# EAGLE design 0118-LEDz (EAGLE 9.6.2)
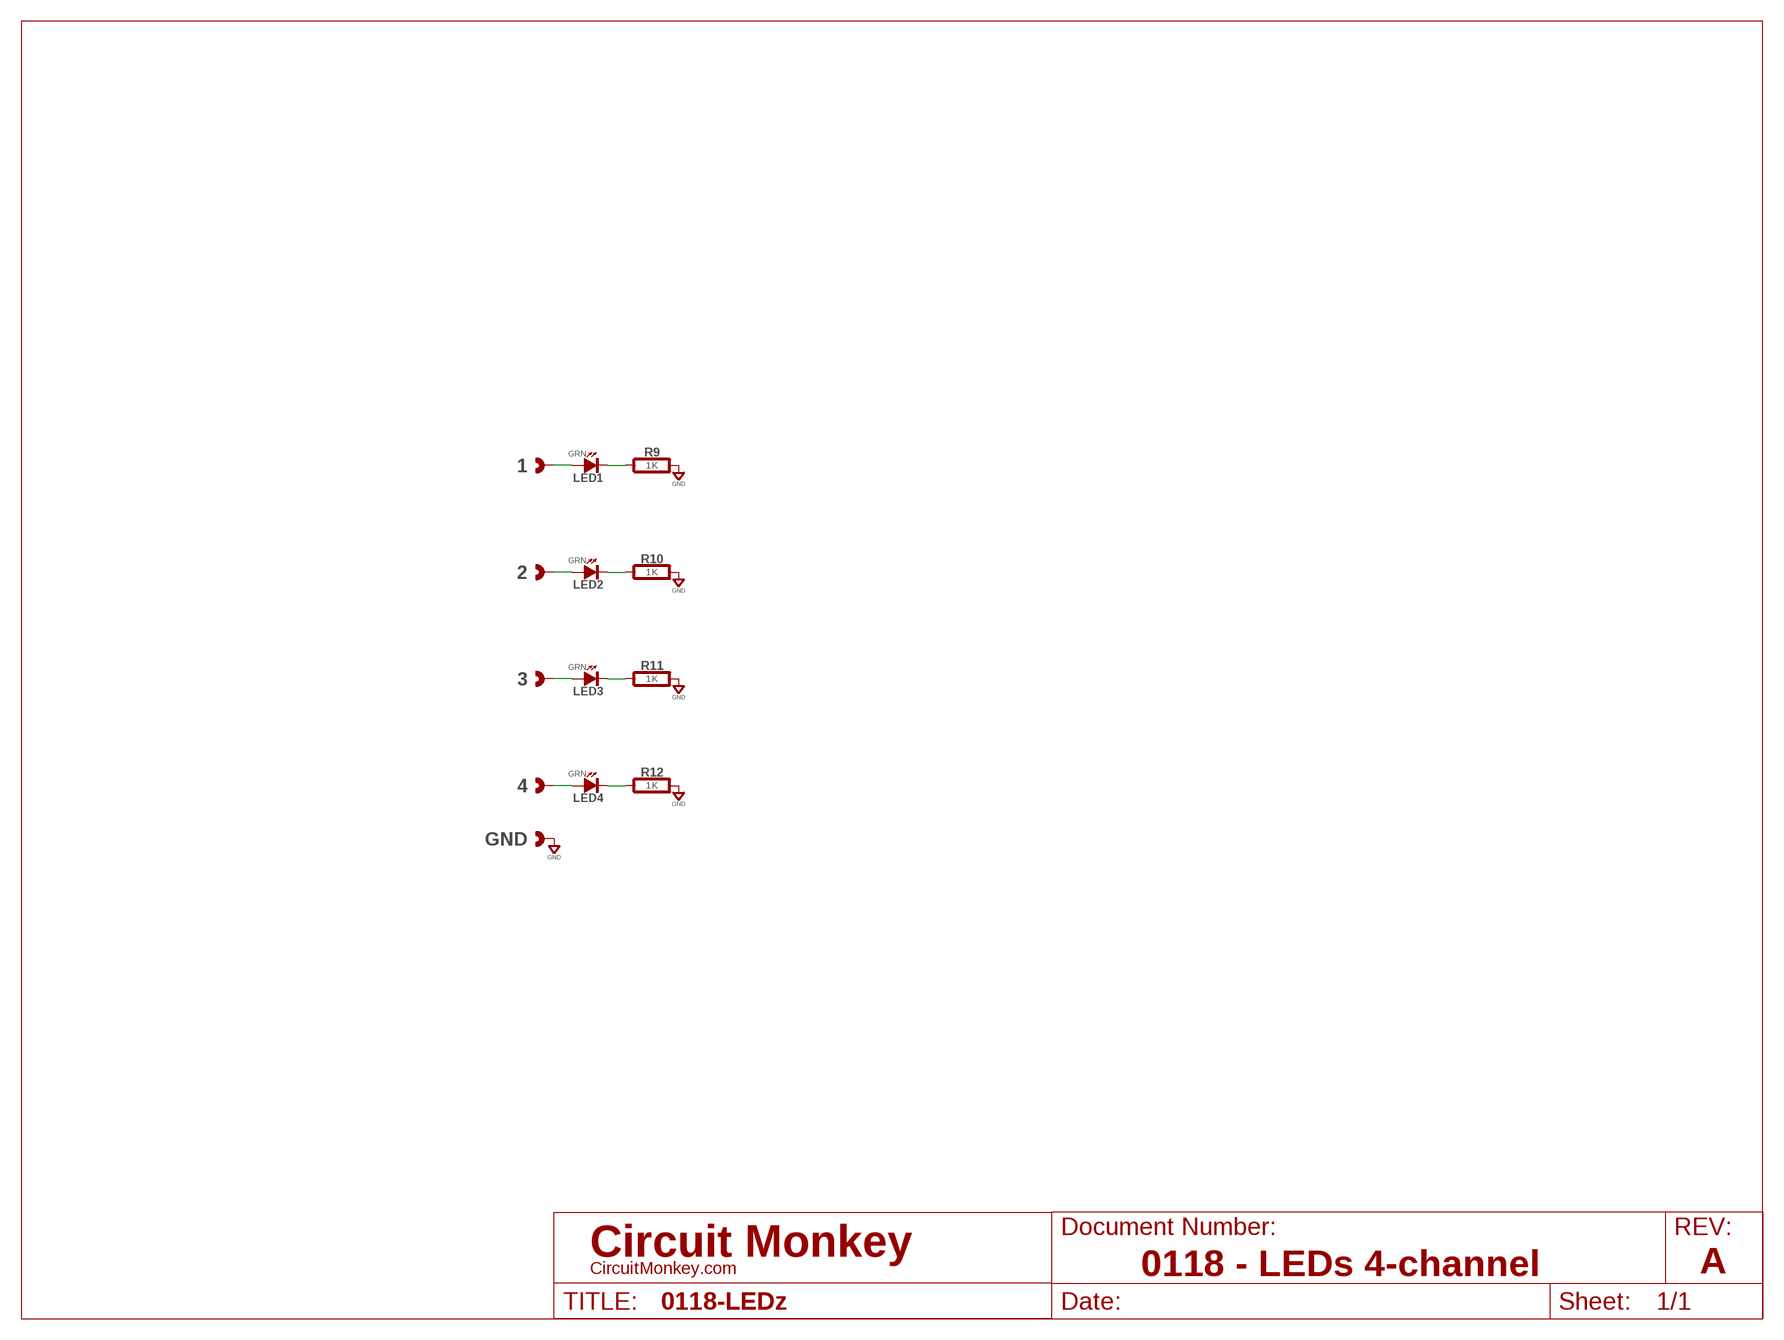
[diagram p0: schematic, sheet 1]
U$1 (LETTER_L-CIRCUITMONKEY): DOCUMENT_NUMBER: 0118 - LEDs 4-channel; REV: A

## Parts
1  CAST-01X12.00MM  [CAST01-2.00MM]
2  CAST-01X12.00MM  [CAST01-2.00MM]
3  CAST-01X12.00MM  [CAST01-2.00MM]
4  CAST-01X12.00MM  [CAST01-2.00MM]
GND  CAST-01X12.00MM  [CAST01-2.00MM]
LED1  GRN  SMT0603  [SMD_0603]
LED2  GRN  SMT0603  [SMD_0603]
LED3  GRN  SMT0603  [SMD_0603]
LED4  GRN  SMT0603  [SMD_0603]
R9  1K  RESISTOR0603  [0603-RES]
R10  1K  RESISTOR0603  [0603-RES]
R11  1K  RESISTOR0603  [0603-RES]
R12  1K  RESISTOR0603  [0603-RES]

## Nets
GND: GND.1 GND.P$1 GND.P$2 R9.2 R10.2 R11.2 R12.2
N$2: LED1.K(C) R9.1
N$6: LED2.K(C) R10.1
N$9: 1.1 1.P$1 1.P$2 LED1.A
N$10: 2.1 2.P$1 2.P$2 LED2.A
N$11: 3.1 3.P$1 3.P$2 LED3.A
N$12: 4.1 4.P$1 4.P$2 LED4.A
N$17: LED3.K(C) R11.1
N$19: LED4.K(C) R12.1

## Library data of the parts
1-4 GND = con-headers:CAST-01X1: Castelated Edge Hole Pad
LED1-LED4 = led:SMT: LED SMT
R9-R12 = rlc:RESISTOR: Resistor

## Board
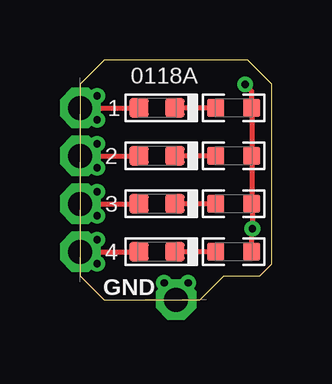
[diagram p1: board, top side]
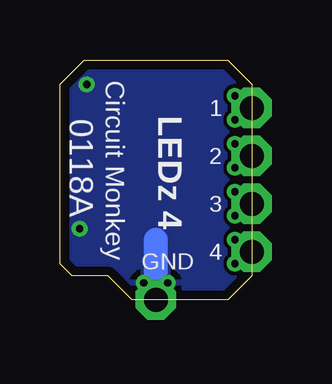
[diagram p2: board, bottom side, seen from below]

Size 8 x 10 mm. Coordinates in mm from the lower left corner, seen from the top.
Outline: 1,0 5,0 6,1 7.5,1 8,1.5 8,9 7,10 1,10 0,9 0,1 1,0
Copper layers (1*16): Top 0.0356mm / dielectric 1.5011mm / Bottom 0.0356mm
Design rules "OSH-CircuitMonkey *": minimum track width 6mil, minimum drill 12mil, track to track 6mil, track to pad 6mil, pad to pad 6mil, via to via 6mil, smd to smd 6mil, copper to edge 15mil, drill to drill 6mil, minimum pad ring 7mil, minimum via ring 7mil, stop-mask expansion 3mil, vias tented up to drill 13mil, thermal gap 10mil

### Footprints (pad centres in the part's own frame; a part is rotated, then mirrored left to right if it is on the bottom)
CAST01-2.00MM = drill 1 pad 1.7 octagon: 1 0,0 | drill 0.305: P$1 -0.7,0.5; P$2 -0.7,-0.5
SMD_0603 = smd 0.8 x 0.8: A 0.75,0; K -0.75,0
0603-RES = smd 0.711 x 0.762: 1 -0.752,0; 2 0.752,0

### Placement (x,y rotation side)
1  0,8 180 top
2  0,6 180 top
3  0,4 180 top
4  0,2 180 top
GND  4,0 270 top
LED1  3.2,8 180 top
LED2  3.2,6 180 top
LED3  3.2,4 180 top
LED4  3.2,2 180 top
R9  6.4,8 0 top
R10  6.4,6 0 top
R11  6.4,4 0 top
R12  6.4,2 0 top

### Tracks (layer width: path | path; a pad name or v marks a point on that pad's centre or on a via)
GND  (via drill 0.3)
  Top 0.152: R10.2 | R9.2 7.15,8.05 | R11.2 7.15,4.01 | R12.2 7.15,2.03
  Top 0.2: R12.2 7.15,2.93 v7.18,2.96 7.18,3.97 R11.2 R10.2 R9.2 7.15,8.71 v6.88,8.98
  Bottom 0.152: GND.1 3.9,0 4.17,0.28 3.85,0.3 3.85,0.15 GND.1 | GND.P$1 GND.P$2 3.5,0.5 GND.1
  Bottom 1: GND.1 4,2.5
  pour Bottom (rank 5): 5,0 1,0 0,1 0,9 1,10 7,10 8,9 8,1.5 7,0.5 5.5,0.5
N$2
  Top 0.2: R9.1 LED1.K
N$6
  Top 0.2: R10.1 LED2.K
N$9
  Top 0.16: 0.2,8 1.P$1 | 1.1 0.2,8 | 0.2,8 1.P$2
  Top 0.2: 1.1 LED1.A
N$10
  Top 0.16: 0.2,6 2.P$2 | 2.1 0.2,6 | 0.2,6 2.P$1
  Top 0.2: 2.1 LED2.A
N$11
  Top 0.152: 0.2,4 3.P$2 | 3.1 0.2,4 | 0.2,4 3.P$1
  Top 0.2: 3.1 LED3.A
N$12
  Top 0.152: 0.2,2 4.P$1 | 4.1 0.2,2 | 0.2,2 4.P$2
  Top 0.2: 4.1 LED4.A
N$17
  Top 0.2: R11.1 LED3.K
N$19
  Top 0.2: R12.1 LED4.K

### Text on the board
tPlace: 0118A
bPlace: 1 | 2 | 0118A | LEDz 4 | Circuit Monkey | 3 | 4 | GND